# Altium schematic sheet SHUTDOWN_EXTERNAL.SchDoc
size 251 x 160 mm; Origin: Eagle
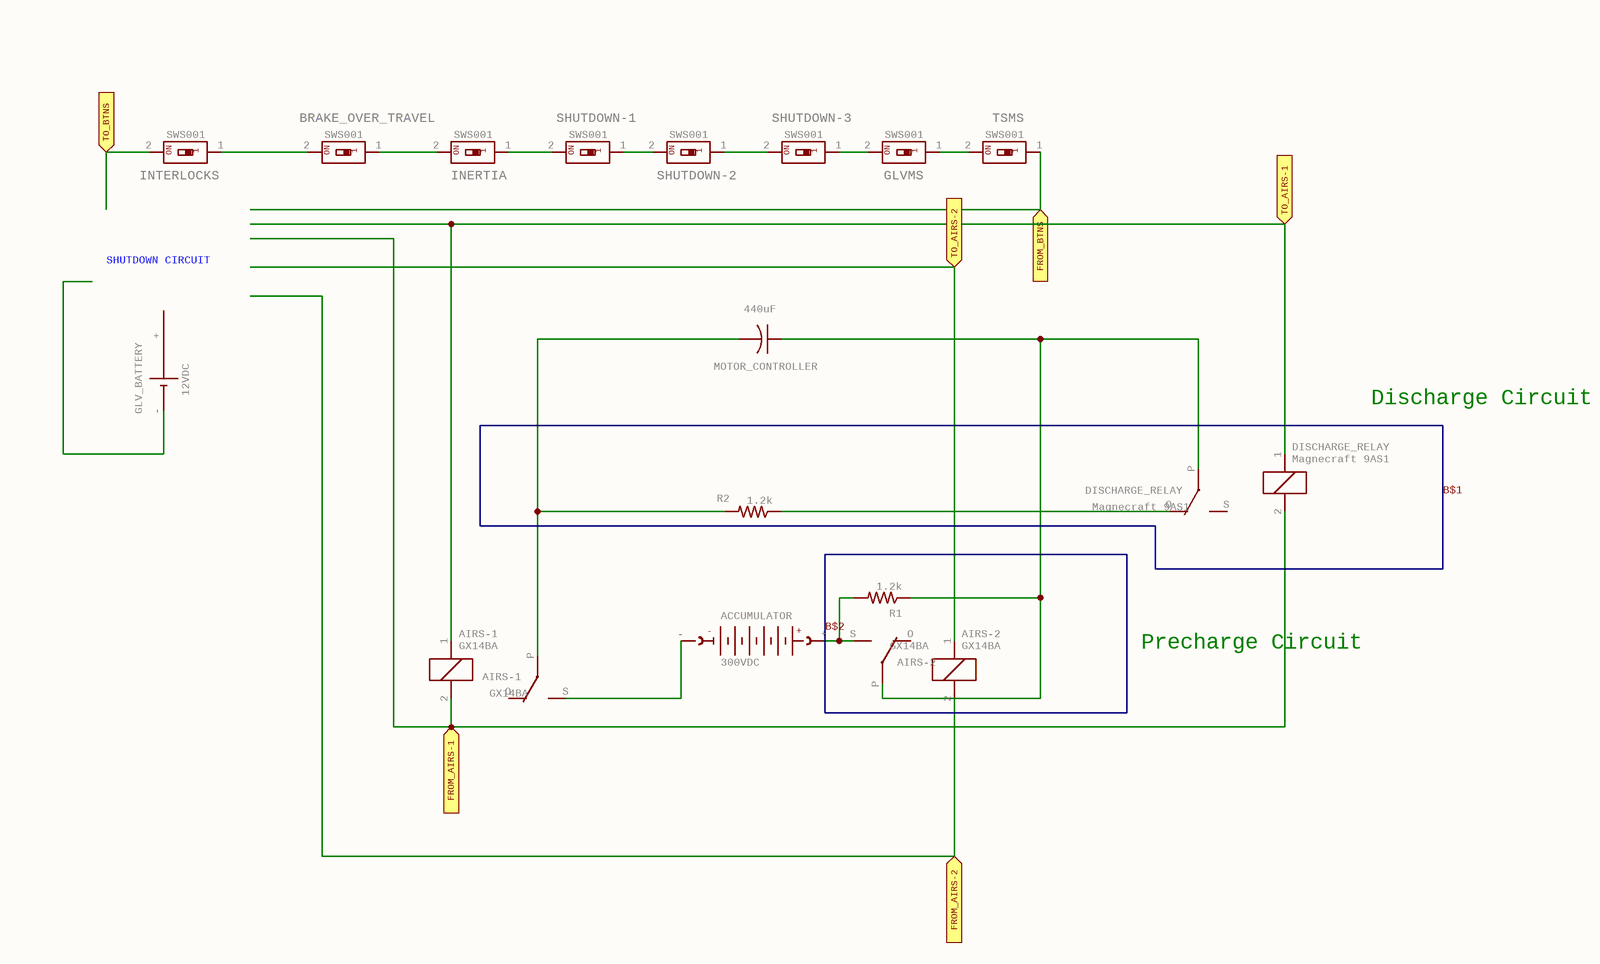
[diagram p0: SHUTDOWN_EXTERNAL.SchDoc]

## Parts
ACCUMULATOR  300VDC  [AB9V]
AIRS-1  GX14BA  PART: AIRS-1  [V23127A]  (parts A,B of 2)
AIRS-2  GX14BA  PART: AIRS-2  [V23127A]  (parts A,B of 2)
BRAKE_OVER_TRAVEL  SWS001  [SMS-001]
DISCHARGE_RELAY  Magnecraft 9AS1  PART: DISCHARGE_RELAY  [V23127A]  (parts A,B of 2)
GLV_BATTERY  12VDC  [B2430UNI]
GLVMS  SWS001  [SMS-001]
INERTIA  SWS001  [SMS-001]
INTERLOCKS  SWS001  [SMS-001]
MOTOR_CONTROLLER  440uF  [C025-024X044]
R1  1.2k  [0411/15]
R2  1.2k  [0411/15]
SHUTDOWN-1  SWS001  [SMS-001]
SHUTDOWN-2  SWS001  [SMS-001]
SHUTDOWN-3  SWS001  [SMS-001]
TSMS  SWS001  [SMS-001]

## Ports
FROM_AIRS-1 (in), FROM_AIRS-2 (in), FROM_BTNS (in), TO_AIRS-1 (in), TO_AIRS-2 (in), TO_BTNS (in)

## Nets
B$2: ACCUMULATOR.+ AIRS-2.S R1.2
FROM_AIRS-1: AIRS-1.2 DISCHARGE_RELAY.2 ; port FROM_AIRS-1
FROM_AIRS-2: AIRS-2.2 AIRS-2.P DISCHARGE_RELAY.P MOTOR_CONTROLLER.1 R1.1 ; port FROM_AIRS-2
FROM_BTNS: TSMS.1 ; port FROM_BTNS
TO_AIRS-1: AIRS-1.1 DISCHARGE_RELAY.1 ; port TO_AIRS-1
TO_AIRS-2: AIRS-2.1 ; port TO_AIRS-2
TO_BTNS: INTERLOCKS.2 ; port TO_BTNS
NetACCUMULATOR_-: ACCUMULATOR.- AIRS-1.S
NetAIRS-1_P: AIRS-1.P MOTOR_CONTROLLER.2 R2.2
NetBRAKE_OVER_TRAVEL_1: BRAKE_OVER_TRAVEL.1 INERTIA.2
NetBRAKE_OVER_TRAVEL_2: BRAKE_OVER_TRAVEL.2 INTERLOCKS.1
NetDISCHARGE_RELAY_O: DISCHARGE_RELAY.O R2.1
NetGLVMS_1: GLVMS.1 TSMS.2
NetGLVMS_2: GLVMS.2 SHUTDOWN-3.1
NetINERTIA_1: INERTIA.1 SHUTDOWN-1.2
NetSHUTDOWN-1_1: SHUTDOWN-1.1 SHUTDOWN-2.2
NetSHUTDOWN-2_1: SHUTDOWN-2.1 SHUTDOWN-3.2

Not connected (* = marked no-connect by the designer): AIRS-1 O; AIRS-2 O; DISCHARGE_RELAY S; GLV_BATTERY + +@1(+) +@2(+) +@3(+) +@4(+) - -@1(-)

## Buses and harness runs
bus B$1

## Notes on the sheet
- SHUTDOWN CIRCUIT
- Discharge Circuit
- Precharge Circuit

## Library data of the parts
ACCUMULATOR = AB9V: 9-V BATTERY CLIP; GateName_1: G$1; SymbolName_1: 9V0-BL; LibraryName: battery; DeviceSetName: AB9V; +: +; -: -
AIRS-1 AIRS-2 DISCHARGE_RELAY = V23127A: RELAY   horizontal, 1 x switch, 5 A/300 V DC, 250 V AC, Siemens; GateName_1: 1; SymbolName_1: K; GateName_2: 2; SymbolName_2: U; LibraryName: relay; DeviceSetName: V23127A; MF: MF; MPN: MPN; OC_FARNELL: unknown; OC_NEWARK: unknown
BRAKE_OVER_TRAVEL GLVMS INERTIA INTERLOCKS SHUTDOWN-1-SHUTDOWN-3 TSMS = SWS001: SMD Dip Switch 1 pol.; GateName_1: G$1; SymbolName_1: DIP01; LibraryName: smd-special; DeviceSetName: SWS001; ON: ON; 1: 1
GLV_BATTERY = B2430UNI: LI BATTERY; GateName_1: G$1; SymbolName_1: 1V2-2+5; LibraryName: battery; DeviceSetName: B2430UNI
MOTOR_CONTROLLER = C-US025-024X044: CAPACITOR, American symbol; GateName_1: G$1; SymbolName_1: C-US; DeviceName: 025-024X044; LibraryName: rcl; DeviceSetName: C-US; SPICEPREFIX: C
R1 R2 = R-US_0411/15: RESISTOR, American symbol; GateName_1: G$1; SymbolName_1: R-US; DeviceSetName: R-US_; DeviceName: 0411/15; LibraryName: rcl; SPICEPREFIX: R